# Altium schematic sheet DemoCat.SchDoc
size A4
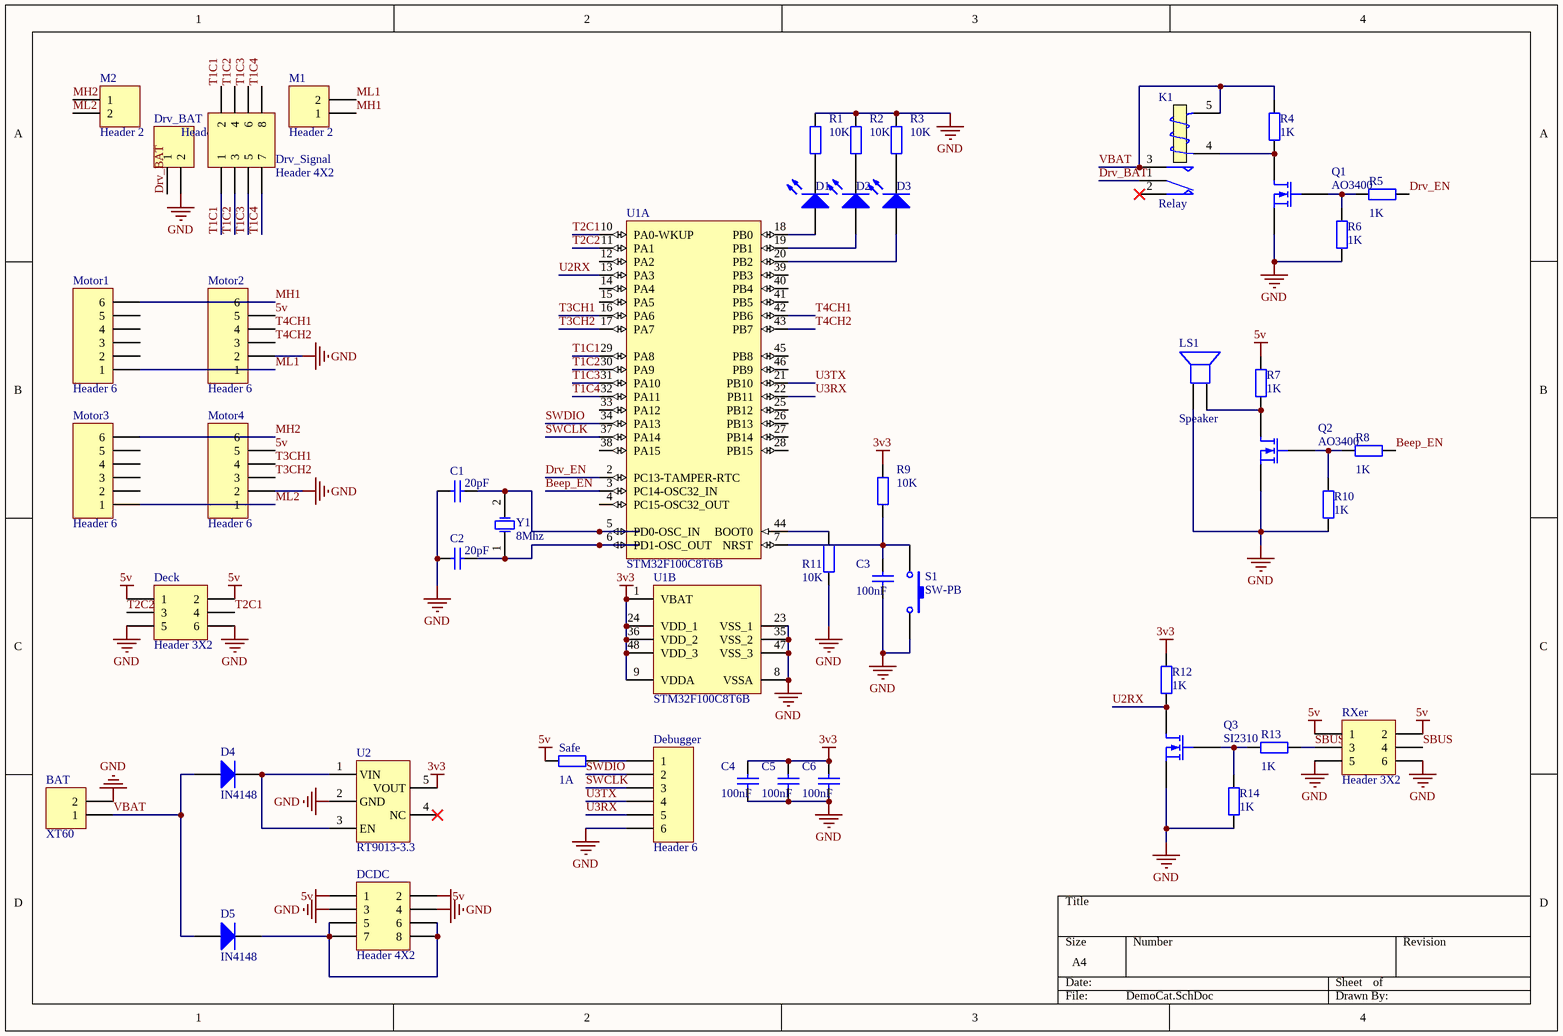
[diagram p0: DemoCat.SchDoc]

## Parts
BAT  XT60  [XT30-IN-W]
C1  value 20pF  [0603C]  (hidden comment: Cap)
C2  value 20pF  [0603C]  (hidden comment: Cap)
C3  value 100nF  [0603C]  (hidden comment: Cap)
C4  value 100nF  [0603C]  (hidden comment: Cap)
C5  value 100nF  [0603C]  (hidden comment: Cap)
C6  value 100nF  [0603C]  (hidden comment: Cap)
D1  LED0  [0603LED - Red]  (value not drawn)
D2  LED0  [0603LED - Green]  (value not drawn)
D3  LED0  [0603LED - Blue]  (value not drawn)
D4  IN4148  [DO-214AA(SMB)]
D5  IN4148  [DO-214AA(SMB)]
DCDC  Header 4X2  [HDR_SMT_2x4]
Debugger  Header 6  [GX1.25_T_6P]
Deck  Header 3X2  [HDR_SMT_2x3]
Drv_BAT  Header 2  [XH2.54_2P_T]
Drv_Signal  Header 4X2  [HDR_SMT_2x4]
K1  Relay  [rl]
LS1  Speaker  [PIN2]
M1  Header 2  [XH2.54_2P_T]
M2  Header 2  [XH2.54_2P_T]
Motor1  Header 6  [HDR_SMT_1x6]
Motor2  Header 6  [HDR_SMT_1x6]
Motor3  Header 6  [HDR_SMT_1x6]
Motor4  Header 6  [HDR_SMT_1x6]
Q1  AO3400  [SOT-23-MOS]
Q2  AO3400  [SOT-23-MOS]
Q3  SI2310  [SOT-23-MOS]
R1  10K  [0603R]
R2  10K  [0603R]
R3  10K  [0603R]
R4  value 1K  [0603R]  (hidden comment: Res2)
R5  value 1K  [0603R]  (hidden comment: Res2)
R6  value 1K  [0603R]  (hidden comment: Res2)
R7  value 1K  [0603R]  (hidden comment: Res2)
R8  value 1K  [0603R]  (hidden comment: Res2)
R9  10K  [0603R]
R10  value 1K  [0603R]  (hidden comment: Res2)
R11  value 10K  [0603R]  (hidden comment: Res2)
R12  value 1K  [0603R]  (hidden comment: Res2)
R13  value 1K  [0603R]  (hidden comment: Res2)
R14  value 1K  [0603R]  (hidden comment: Res2)
RXer  Header 3X2  [HDR_SMT_2x3]
S1  SW-PB  [KeySwitch-3X3]
Safe  value 1A  [0603R]  (hidden comment: Res2)
U1  STM32F100C8T6B  [STM-LQFP48_N]  (parts A,B of 2)
U2  RT9013-3.3  [SOT-23-5]
Y1  8Mhz  [3225-CrystalOsclitor]

## Nets
3v3: C4.2 C5.2 C6.2 R9.2 R12.2 U1.1(VBAT) U1.9(VDDA) U1.24(VDD_1) U1.36(VDD_2) U1.48(VDD_3) U2.5(VOUT)
5v: DCDC.1 DCDC.2 Deck.1 Deck.2 Motor2.5 Motor4.5 R7.2 RXer.1 RXer.2 Safe.1
GND: BAT.2 C1.1 C2.1 C3.1 C4.1 C5.1 C6.1 DCDC.3 DCDC.4 Debugger.6 Deck.5 Deck.6 Drv_BAT.2 LS1.1 Motor2.2 Motor4.2 Q1.3(S) Q2.3(S) Q3.3(S) R1.2 R2.2 R3.2 R6.1 R10.1 R11.1 R14.1 RXer.5 RXer.6 S1.2 U1.8(VSSA) U1.23(VSS_1) U1.35(VSS_2) U1.47(VSS_3) U2.2(GND)
Beep_EN: R8.2 U1.3(PC14-OSC32_IN)
Drv_BAT: Drv_BAT.1 K1.1(COM)
Drv_EN: R5.2 U1.2(PC13-TAMPER-RTC)
MH1: M1.1 Motor1.6 Motor2.6
MH2: M2.1 Motor3.6 Motor4.6
ML1: M1.2 Motor1.1 Motor2.1
ML2: M2.2 Motor3.1 Motor4.1
SBUS: R13.2 RXer.3 RXer.4
SWCLK: Debugger.3 U1.37(PA14)
SWDIO: Debugger.2 U1.34(PA13)
T1C1: Drv_Signal.1 Drv_Signal.2 U1.29(PA8)
T1C2: Drv_Signal.3 Drv_Signal.4 U1.30(PA9)
T1C3: Drv_Signal.5 Drv_Signal.6 U1.31(PA10)
T1C4: Drv_Signal.7 Drv_Signal.8 U1.32(PA11)
T2C1: Deck.4 U1.10(PA0-WKUP)
T2C2: Deck.3 U1.11(PA1)
T3CH1: Motor4.4 U1.16(PA6)
T3CH2: Motor4.3 U1.17(PA7)
T4CH1: Motor2.4 U1.42(PB6)
T4CH2: Motor2.3 U1.43(PB7)
U2RX: Q3.1(D) R12.1 U1.13(PA3)
U3RX: Debugger.5 U1.22(PB11)
U3TX: Debugger.4 U1.21(PB10)
VBAT: BAT.1 D4.1(A) D5.1(A) K1.3(NO) K1.5(T2) R4.2
NetC1_2: C1.2 U1.5(PD0-OSC_IN) Y1.2(OSC2)
NetC2_2: C2.2 U1.6(PD1-OSC_OUT) Y1.1(OSC1)
NetC3_2: C3.2 R9.1 S1.1 U1.7(NRST)
NetD1_1: D1.1(A) U1.18(PB0)
NetD1_2: D1.2(K) R1.1
NetD2_1: D2.1(A) U1.19(PB1)
NetD2_2: D2.2(K) R2.1
NetD3_1: D3.1(A) U1.20(PB2)
NetD3_2: D3.2(K) R3.1
NetD4_2: D4.2(K) U2.1(VIN) U2.3(EN)
NetD5_2: D5.2(K) DCDC.5 DCDC.6 DCDC.7 DCDC.8
NetDebugger_1: Debugger.1 Safe.2
NetK1_4: K1.4(T1) Q1.1(D) R4.1
NetLS1_2: LS1.2 Q2.1(D) R7.1
NetQ1_2: Q1.2(G) R5.1 R6.2
NetQ2_2: Q2.2(G) R8.1 R10.2
NetQ3_2: Q3.2(G) R13.1 R14.2
NetR11_2: R11.2 U1.44(BOOT0)

Not connected (* = marked no-connect by the designer): K1 2(NC)*; Motor1 2 3 4 5; Motor3 2 3 4 5; U1 4(PC15-OSC32_OUT) 12(PA2) 14(PA4) 15(PA5) 25(PB12) 26(PB13) 27(PB14) 28(PB15) 33(PA12) 38(PA15) 39(PB3) 40(PB4) 41(PB5) 45(PB8) 46(PB9); U2 4(NC)*

## Library data of the parts
BAT Drv_BAT M1 M2 = Header 2: Header, 2-Pin; LatestRevisionDate: 17-Jul-2002; LatestRevisionNote: Re-released for DXP Platform.; Publisher: Altium Limited
C1-C6 = Cap: Capacitor; Published: 8-Jun-2000; LatestRevisionDate: 17-Jul-2002; LatestRevisionNote: Re-released for DXP Platform.; PackageReference: RAD-0.3; Publisher: Altium Limited; PackageDescription: Radial Cap, Thru-Hole; 2 Leads; 0.3 in Pin Spacing
D1-D3 = LED0: Typical INFRARED GaAs LED; Published: 8-Jun-2000; LatestRevisionDate: 08-Jul-2005; LatestRevisionNote: Mech Layer 1 removed.; PackageReference: LED-0; Publisher: Altium Limited; PackageDescription: LED; 2 Leads
D4 D5 = Diode: Default Diode; Published: 8-Jun-2000; LatestRevisionDate: 17-Jul-2002; LatestRevisionNote: Re-released for DXP Platform.; PackageVersion: Sep-1996; PackageReference: SMC; Publisher: Altium Limited; PackageDescription: DO-214-AB/SMC; 2 C-Bend Leads; Body 7.9 x 5.9 mm, inc. leads (LxW); Code_JEDEC: DO-214-AB
DCDC Drv_Signal = Header 4X2: Header, 4-Pin, Dual row; LatestRevisionDate: 17-Jul-2002; LatestRevisionNote: Re-released for DXP Platform.; Publisher: Altium Limited
Debugger Motor1-Motor4 = Header 6: Header, 6-Pin; LatestRevisionDate: 17-Jul-2002; LatestRevisionNote: Re-released for DXP Platform.; Publisher: Altium Limited
Deck RXer = Header 3X2: Header, 3-Pin, Dual row; LatestRevisionDate: 17-Jul-2002; LatestRevisionNote: Re-released for DXP Platform.; Publisher: Altium Limited
K1 = Relay: SPDT Relay; Published: 8-Jun-2000; LatestRevisionDate: 17-Jul-2002; LatestRevisionNote: Re-released for DXP Platform.; PackageReference: MODULE5B; Publisher: Altium Limited
LS1 = Speaker: Loudspeaker; Published: 24-Mar-1999; LatestRevisionDate: 17-Jul-2002; LatestRevisionNote: Re-released for DXP Platform.; PackageReference: PIN2; Publisher: Altium Limited
Q1-Q3 = MOSFET-N: N-Channel MOSFET; Published: 8-Jun-2000; LatestRevisionDate: 17-Jul-2002; LatestRevisionNote: Re-released for DXP Platform.; PackageVersion: 1995/1996; PackageReference: E3; Publisher: Altium Limited; PackageDescription: TO, Flat Index; 3 In-Line, Axial Leads; Body Dia. 4.6mm; Lead Dia. 0.5 mm (max)
R1-R14 Safe = Res2: Resistor; Published: 8-Jun-2000; LatestRevisionDate: 17-Jul-2002; LatestRevisionNote: Re-released for DXP Platform.; PackageReference: AXIAL-0.4; Publisher: Altium Limited; PackageDescription: Axial Device, Thru-Hole; 2 Leads; 0.4 in Pin Spacing
  R1-R3 R9: Value: 10K
S1 = SW-PB: Switch; Published: 24-Mar-1999; LatestRevisionDate: 17-Jul-2002; LatestRevisionNote: Re-released for DXP Platform.; PackageReference: SPST-2; Publisher: Altium Limited; PackageDescription: Switch; 2 Leads
U1 = STM32F100C8T6B: ARM Cortex-M3 32-bit MCU, 64 KB Flash, 8 KB Internal RAM, 37 I/Os, 48-pin LQFP, -40 to 85 degC, Tray; A/D Converter: 1x12-bit (10 Channel); D/A Converter: 2x12-bit (2 Channel); FLASH Size (Prog) (kB): 64; I/Os (High Current): 37; Internal RAM Size (kB): 8; Operating Frequency(F) (Processor speed) (MHz): 24; Supply Voltage(Vcc) min (V): 2; DatasheetVersion: Rev. 7; PackageVersion: Rev. 6, 06/2013; PackageReference: LQFP48; PackageDescription: 48-Pin Low Profile Quad Flat Package, 7 x 7 mm Body, 0.5 mm Pitch; Supplier 1: Digi-Key; Supplier Part Number 1: 497-10499-ND; Supplier 2: Farnell; Supplier Part Number 2: 1838511; Supplier 3: Newark; Supplier Part Number 3: 76R0988; Supplier 4: Mouser; Supplier Part Number 4: 511-STM32F100C8T6B; Core: ARM Cortex-M3; Packing: Tray; Mounting Technology: Surface Mount; PartNumber: STM32F100C8T6B; ComponentLink1Description: Manufacturer URL; ComponentLink1URL: http://www.st.com/web/en/home.html; ComponentLink2Description: Datasheet; ComponentLink2URL: http://www.st.com/st-web-ui/static/active/en/resource/technical/document/datasheet/CD00251732.pdf; ComponentLink3Description: Package Specification; ComponentLink3URL: http://www.st.com/st-web-ui/static/active/en/resource/technical/document/datasheet/DM00058181.pdf
U2 = RT9013: 3.3V 500mA
Y1 = XTAL: Published: 8-Jun-2000; LatestRevisionDate: 17-Jul-2002; LatestRevisionNote: Re-released for DXP Platform.; PackageReference: R38; Publisher: Altium Limited; PackageDescription: Crystal, Thru-Hole; 2 Leads; Body 3.1 x 8.2 mm (Dia.xH)